# Altium schematic sheet blackfin_c_ethernet.SchDoc: Ethernet
size A3; SheetNumber: 3; SheetTotal: 6
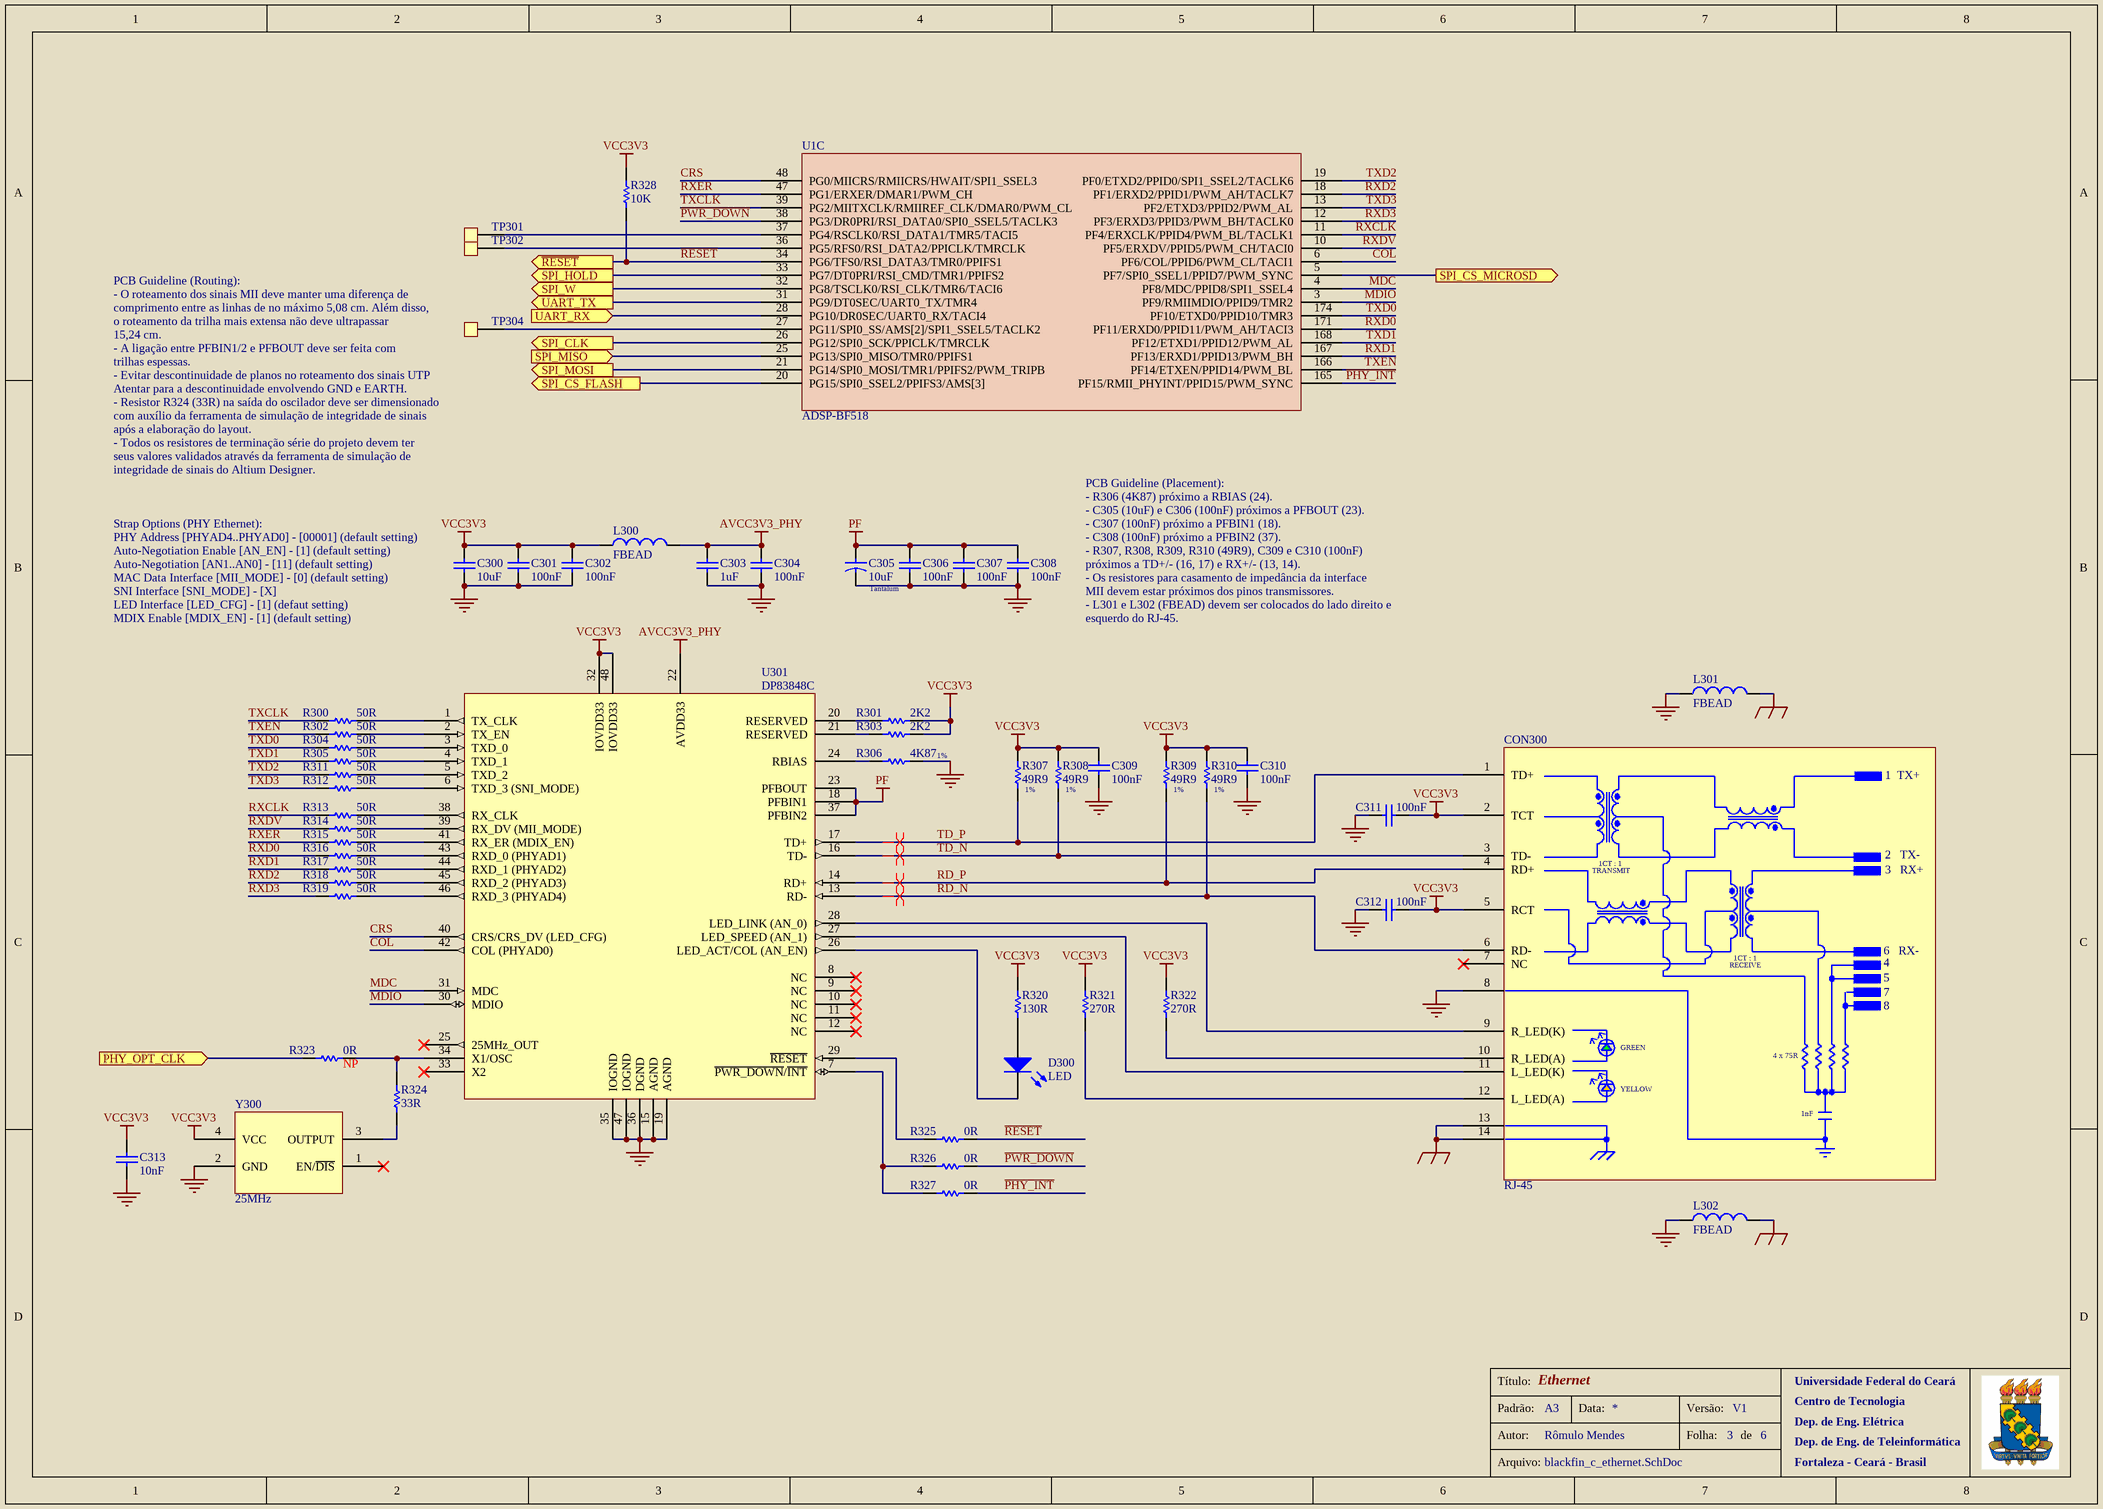
[diagram p0: blackfin_c_ethernet.SchDoc]

## Parts
C300  10uF  [C_0805]
C301  100nF  [C_0603]
C302  100nF  [C_0603]
C303  1uF  [C_0603]
C304  100nF  [C_0603]
C305  10uF  [C_Case_A]
C306  100nF  [C_0603]
C307  100nF  [C_0603]
C308  100nF  [C_0603]
C309  100nF  [C_0603]
C310  100nF  [C_0603]
C311  100nF  [C_0603]
C312  100nF  [C_0603]
C313  10nF  [C_0603]
CON300  RJ-45  [RJ-45]
D300  LED  [LED_0603]
L300  FBEAD  [L_0603]
L301  FBEAD  [L_0603]
L302  FBEAD  [L_0603]
R300  50R  [R_0402]
R301  2K2  [R_0603]
R302  50R  [R_0402]
R303  2K2  [R_0603]
R304  50R  [R_0402]
R305  50R  [R_0402]
R306  4K87  [R_0603]
R307  49R9  [R_0603]
R308  49R9  [R_0603]
R309  49R9  [R_0603]
R310  49R9  [R_0603]
R311  50R  [R_0402]
R312  50R  [R_0402]
R313  50R  [R_0402]
R314  50R  [R_0402]
R315  50R  [R_0402]
R316  50R  [R_0402]
R317  50R  [R_0402]
R318  50R  [R_0402]
R319  50R  [R_0402]
R320  130R  [R_0603]
R321  270R  [R_0603]
R322  270R  [R_0603]
R323  0R  [R_0603]
R324  33R  [R_0402]
R325  0R  [R_0603]
R326  0R  [R_0603]
R327  0R  [R_0603]
R328  10K  [R_0603]
TP301  Test Point  [Test Point]  (value not drawn)  (no BOM)
TP302  Test Point  [Test Point]  (value not drawn)  (no BOM)
TP304  Test Point  [Test Point]  (value not drawn)  (no BOM)
U1  ADSP-BF518  [LQFP-176]  (part C of 4)
U301  DP83848C  [LQFP-48]
Y300  25MHz  [OSC_25MHz]

## Ports
PHY_OPT_CLK (in), SPI_CLK (out), SPI_CS_FLASH (out), SPI_CS_MICROSD (out), SPI_HOLD (out), SPI_MISO (in), SPI_MOSI (out), SPI_W (out), UART_RX (in), UART_TX (out), ~{RESET} (out)

## Nets
AVCC3V3_PHY: C303.2 C304.2 L300.2 U301.22(AVDD33)
EARTH_ETH: CON300.13(GND) CON300.14(GND) L301.2 L302.2
GND: C300.1 C301.1 C302.1 C303.1 C304.1 C305.2 C306.1 C307.1 C308.1 C309.1 C310.1 C311.2 C312.2 C313.1 CON300.8(GND) L301.1 L302.1 R306.1 U301.15(AGND) U301.19(AGND) U301.35(IOGND) U301.36(DGND) U301.47(IOGND) Y300.2(GND)
PF: C305.1 C306.2 C307.2 C308.2 U301.18(PFBIN1) U301.23(PFBOUT) U301.37(PFBIN2)
VCC3V3: C300.2 C301.2 C302.2 C309.2 C310.2 C311.1 C312.1 C313.2 CON300.2(TCT) CON300.5(RCT) L300.1 R301.1 R303.1 R307.2 R308.2 R309.2 R310.2 R320.2 R321.2 R322.2 R328.1 U301.32(IOVDD33) U301.48(IOVDD33) Y300.4(VCC)
COL: U1.6(PF6/COL/PPID6/PWM_CL/TACI1) U301.42(COL_(PHYAD0))
CRS: U1.48(PG0/MIICRS/RMIICRS/HWAIT/SPI1_SSEL3) U301.40(CRS/CRS_DV_(LED_CFG))
MDC: U1.4(PF8/MDC/PPID8/SPI1_SSEL4) U301.31(MDC)
MDIO: U1.3(PF9/RMIIMDIO/PPID9/TMR2) U301.30(MDIO)
~{PHY_INT}: R327.2 U1.165(PF15/RMII_PHYINT/PPID15/PWM_SYNC)
~{PWR_DOWN}: R326.2 U1.38(PG3/DR0PRI/RSI_DATA0/SPI0_SSEL5/TACLK3)
PHY_OPT_CLK: R323.1 ; port PHY_OPT_CLK
~{RESET}: R325.2 R328.2 U1.34(PG6/TFS0/RSI_DATA3/TMR0/PPIFS1) ; port ~{RESET}
RD_N: CON300.6(RD-) R310.1 U301.13(RD-)
RD_P: CON300.4(RD+) R309.1 U301.14(RD+)
RXCLK: R313.1 U1.11(PF4/ERXCLK/PPID4/PWM_BL/TACLK1)
RXD0: R316.1 U1.171(PF11/ERXD0/PPID11/PWM_AH/TACI3)
RXD1: R317.1 U1.167(PF13/ERXD1/PPID13/PWM_BH)
RXD2: R318.1 U1.18(PF1/ERXD2/PPID1/PWM_AH/TACLK7)
RXD3: R319.1 U1.12(PF3/ERXD3/PPID3/PWM_BH/TACLK0)
RXDV: R314.1 U1.10(PF5/ERXDV/PPID5/PWM_CH/TACI0)
RXER: R315.1 U1.47(PG1/ERXER/DMAR1/PWM_CH)
SPI_CLK: U1.26(PG12/SPI0_SCK/PPICLK/TMRCLK) ; port SPI_CLK
SPI_CS_FLASH: U1.20(PG15/SPI0_SSEL2/PPIFS3/AMS[3]) ; port SPI_CS_FLASH
SPI_CS_MICROSD: U1.5(PF7/SPI0_SSEL1/PPID7/PWM_SYNC) ; port SPI_CS_MICROSD
SPI_HOLD: U1.33(PG7/DT0PRI/RSI_CMD/TMR1/PPIFS2) ; port SPI_HOLD
SPI_MISO: U1.25(PG13/SPI0_MISO/TMR0/PPIFS1) ; port SPI_MISO
SPI_MOSI: U1.21(PG14/SPI0_MOSI/TMR1/PPIFS2/PWM_TRIPB) ; port SPI_MOSI
SPI_W: U1.32(PG8/TSCLK0/RSI_CLK/TMR6/TACI6) ; port SPI_W
TD_N: CON300.3(TD-) R308.1 U301.16(TD-)
TD_P: CON300.1(TD+) R307.1 U301.17(TD+)
TXCLK: R300.1 U1.39(PG2/MIITXCLK/RMIIREF_CLK/DMAR0/PWM_CL)
TXD0: R304.1 U1.174(PF10/ETXD0/PPID10/TMR3)
TXD1: R305.1 U1.168(PF12/ETXD1/PPID12/PWM_AL)
TXD2: R311.1 U1.19(PF0/ETXD2/PPID0/SPI1_SSEL2/TACLK6)
TXD3: R312.1 U1.13(PF2/ETXD3/PPID2/PWM_AL)
TXEN: R302.1 U1.166(PF14/ETXEN/PPID14/PWM_BL)
UART_RX: U1.28(PG10/DR0SEC/UART0_RX/TACI4) ; port UART_RX
UART_TX: U1.31(PG9/DT0SEC/UART0_TX/TMR4) ; port UART_TX
NetCON300_9: CON300.9(R_LED(K)) U301.28(LED_LINK_(AN_0))
NetCON300_10: CON300.10(R_LED(A)) R322.1
NetCON300_11: CON300.11(L_LED(K)) U301.27(LED_SPEED_(AN_1))
NetCON300_12: CON300.12(L_LED(A)) R321.1
NetD300_1: D300.1(A) R320.1
NetD300_2: D300.2(K) U301.26(LED_ACT/COL_(AN_EN))
NetR300_2: R300.2 U301.1(TX_CLK)
NetR301_2: R301.2 U301.20(RESERVED)
NetR302_2: R302.2 U301.2(TX_EN)
NetR303_2: R303.2 U301.21(RESERVED)
NetR304_2: R304.2 U301.3(TXD_0)
NetR305_2: R305.2 U301.4(TXD_1)
NetR306_2: R306.2 U301.24(RBIAS)
NetR311_2: R311.2 U301.5(TXD_2)
NetR312_2: R312.2 U301.6(TXD_3_(SNI_MODE))
NetR313_2: R313.2 U301.38(RX_CLK)
NetR314_2: R314.2 U301.39(RX_DV_(MII_MODE))
NetR315_2: R315.2 U301.41(RX_ER_(MDIX_EN))
NetR316_2: R316.2 U301.43(RXD_0_(PHYAD1))
NetR317_2: R317.2 U301.44(RXD_1_(PHYAD2))
NetR318_2: R318.2 U301.45(RXD_2_(PHYAD3))
NetR319_2: R319.2 U301.46(RXD_3_(PHYAD4))
NetR323_2: R323.2 R324.2 U301.34(X1/OSC)
NetR324_1: R324.1 Y300.3(OUTPUT)
NetR325_1: R325.1 U301.29(~{RESET})
NetR326_1: R326.1 R327.1 U301.7(~{PWR_DOWN}/~{INT})
NetTP301_1: TP301.1 U1.37(PG4/RSCLK0/RSI_DATA1/TMR5/TACI5)
NetTP302_1: TP302.1 U1.36(PG5/RFS0/RSI_DATA2/PPICLK/TMRCLK)
NetTP304_1: TP304.1 U1.27(PG11/SPI0_SS/AMS[2]/SPI1_SSEL5/TACLK2)

Not connected (* = marked no-connect by the designer): CON300 7(NC)*; U301 8(NC)* 9(NC)* 10(NC)* 11(NC)* 12(NC)* 25(25MHz_OUT)* 33(X2)*; Y300 1(EN/~{DIS})*

## Layout directives
differential pair: RD_N, RD_P, TD_N, TD_P

## Notes on the sheet
- PCB Guideline (Routing):
- - O roteamento dos sinais MII deve manter uma diferença de
- (near TP304) comprimento entre as linhas de no máximo 5,08 cm. Além disso,
- (near TP304) - A ligação entre PFBIN1/2 e PFBOUT deve ser feita com
- trilhas espessas.
- (near TP304) - Evitar descontinuidade de planos no roteamento dos sinais UTP
- (near TP304) o roteamento da trilha mais extensa não deve ultrapassar
- 15,24 cm.
- Atentar para a descontinuidade envolvendo GND e EARTH.
- - Resistor R324 (33R) na saída do oscilador deve ser dimensionado
- com auxílio da ferramenta de simulação de integridade de sinais
- após a elaboração do layout.
- - Todos os resistores de terminação série do projeto devem ter
- seus valores validados através da ferramenta de simulação de
- integridade de sinais do Altium Designer.
- PCB Guideline (Placement):
- - R306 (4K87) próximo a RBIAS (24).
- - C305 (10uF) e C306 (100nF) próximos a PFBOUT (23).
- Strap Options (PHY Ethernet):
- (near C300) PHY Address [PHYAD4..PHYAD0] - [00001] (default setting)
- (near C300) MAC Data Interface [MII_MODE] - [0] (default setting)
- (near C300) Auto-Negotiation Enable [AN_EN] - [1] (default setting)
- (near C300) Auto-Negotiation [AN1..AN0] - [11] (default setting)
- - C307 (100nF) próximo a PFBIN1 (18).
- - C308 (100nF) próximo a PFBIN2 (37).
- - R307, R308, R309, R310 (49R9), C309 e C310 (100nF)
- próximos a TD+/- (16, 17) e RX+/- (13, 14).
- - Os resistores para casamento de impedância da interface
- SNI Interface [SNI_MODE] - [X]
- LED Interface [LED_CFG] - [1] (defaut setting)
- MDIX Enable [MDIX_EN] - [1] (default setting)
- Tantalum
- - L301 e L302 (FBEAD) devem ser colocados do lado direito e
- esquerdo do RJ-45.
- MII devem estar próximos dos pinos transmissores.
- 1%
- (near R307) 1%
- (near R308) 1%
- (near R309) 1%
- (near R310) 1%
- (near R323) NP
- Título:
- Universidade Federal do Ceará
- Padrão:
- Autor:
- A3
- Rômulo Mendes
- Data:
- Versão:
- Folha:
- V1
- de
- Centro de Tecnologia
- Dep. de Eng. Elétrica
- Dep. de Eng. de Teleinformática
- Arquivo:
- Fortaleza - Ceará - Brasil
- (in symbol RJ-45) 1  TX+; 2   TX-; 1CT : 1; TRANSMIT; 3   RX+; 6   RX-; RECEIVE; GREEN; 4 x 75R; YELLOW; 1nF

## Library data of the parts
C300 = Capacitor: eVendorPart#: 810-C2012Y5V1C106Z; Manufacturer: TDK; Part#: C2012Y5V1C106Z; eVendor: Mouser; eVendorPrice: 0,10; MSRP: 0,05; MOQ: 1000
C301 C302 C304 C306-C312 = Capacitor: eVendorPart#: 81-GRM188R71E104KA01; Manufacturer: Murata; Part#: GRM188R71E104KA01J; eVendor: Mouser; eVendorPrice: 0,14; MSRP: 0,11; MOQ: 1000
C303 = Capacitor: eVendorPart#: 81-GRM188F51E105ZA12; Manufacturer: Murata; Part#: GRM188F51E105ZA12D; eVendor: Mouser; eVendorPrice: 0,07; MSRP: 0,016; MOQ: 1000
C305 = Capacitor_Pol: eVendorPart#: 80-B45196H3106K109; Part#: B45196H3106K109V17; Manufacturer: Kemet; eVendor: Mouser; eVendorPrice: 0,13; MSRP: 0,06; MOQ: 1000
C313 = Capacitor: eVendorPart#: 77-VJ0603Y103KXAPBC; Manufacturer: Vishay/Vitramon; Part#: VJ0603Y103KXAPW1BC; eVendor: Mouser; eVendorPrice: 0,05; MSRP: 0,013; MOQ: 1000
CON300 = RJ-45: eVendorPart#: 673-J1012F01C; Part#: J1012F01C; Manufacturer: Pulse; eVendor: Mouser; eVendorPrice: 7,86; MSRP: 3,86; MOQ: 1000
D300 = LED: Green LED; eVendorPart#: 638-QTLP600C4; Manufacturer: Everlight; Part#: QTLP600C4TR; eVendor: Mouser; eVendorPrice: 0,02; MSRP: 0,075; MOQ: 1000
L300-L302 = Inductor: eVendorPart#: 875-MI0603L301R-10; Manufacturer: Laird Technologies; Part#: MI0603L301R-10; eVendor: Mouser; eVendorPrice: 0,16; MSRP: 0,066; MOQ: 1000
R300 R302 R304 R305 R311-R319 = Resistor: eVendorPart#: 71-CRCW0402-49.9-E3; Part#: CRCW040249R9FKED; Manufacturer: Vishay/Dale; eVendor: Mouser; eVendorPrice: 0,07; MSRP: 0,015; MOQ: 1000
R301 R303 = Resistor: eVendorPart#: 71-CRCW06032K20JNEB; Part#: CRCW06032K20JNEB; Manufacturer: Vishay/Dale; eVendor: Mouser; eVendorPrice: 0,06; MSRP: 0,01; MOQ: 1000
R306 = Resistor: eVendorPart#: 71-CRCW0603-4.87K-E3; Part#: CRCW06034K87FKEA; Manufacturer: Vishay/Dale; eVendor: Mouser; eVendorPrice: 0,06; MSRP: 0,015; MOQ: 1000
R307-R310 = Resistor: eVendorPart#: 71-CRCW060349R9FKEB; Part#: CRCW060349R9FKEB; Manufacturer: Vishay/Dale; eVendor: Mouser; eVendorPrice: 0,06; MSRP: 0,015; MOQ: 1000
R320 = Resistor: eVendorPart#: 71-CRCW0603-130-E3; Part#: CRCW0603130RFKEA; Manufacturer: Vishay/Dale; eVendor: Mouser; eVendorPrice: 0,06; MSRP: 0,015; MOQ: 1000
R321 R322 = Resistor: eVendorPart#: 71-CRCW0603-270-E3; Part#: CRCW0603270RFKEA; Manufacturer: Vishay/Dale; eVendor: Mouser; eVendorPrice: 0,06; MSRP: 0,015; MOQ: 1000
R323 R325-R327 = Resistor: eVendorPart#: 71-CRCW06030000Z0EB; Part#: CRCW06030000Z0EB; Manufacturer: Vishay/Dale; eVendor: Mouser; eVendorPrice: 0,06; MSRP: 0,015; MOQ: 1000
R324 = Resistor: eVendorPart#: 71-CRCW0402J-33-E3; Part#: CRCW040233R0JNED; Manufacturer: Vishay/Dale; eVendor: Mouser; eVendorPrice: 0,06; MSRP: 0,01; MOQ: 1000
R328 = Resistor: eVendorPart#: 71-CRCW0603-10K-E3; Part#: CRCW060310K0FKEA; Manufacturer: Vishay/Dale; eVendor: Mouser; eVendorPrice: 0,06; MSRP: 0,015; MOQ: 1000
TP301 TP302 TP304 = Test Point: eVendor: NÃO SE APLICA; eVendorPrice: 0,00; eVendorPart#: NÃO SE APLICA; Part#: NÃO SE APLICA; Manufacturer: NÃO SE APLICA; MOQ: 1000; MSRP: 0,00
U1 = ADSP-BF518: eVendorPart#: ADSP-BF518BSWZ-4; eVendor: Analog Devices; eVendorPrice: 13,76; MSRP: 13,07; Part#: ADSP-BF518BSWZ-4; Manufacturer: Analog Devices; MOQ: 1000
U301 = DP83848C: Manufacturer: National Semiconductor; Part#: DP83848CVV/NOPB; eVendorPart#: DP83848CVV-ND; eVendor: Digikey; MSRP: 3,672; eVendorPrice: 6,8; MOQ: 1000
Y300 = Oscillator_25MHz: eVendorPart#: 815-ASV-25-EJ-T; Part#: ASV-25.000MHZ-EJ-T; Manufacturer: ABRACON; eVendor: Mouser; eVendorPrice: 2,89; MSRP: 1,12; MOQ: 1000